# Altium schematic sheet POWER_B3.SchDoc
size A4
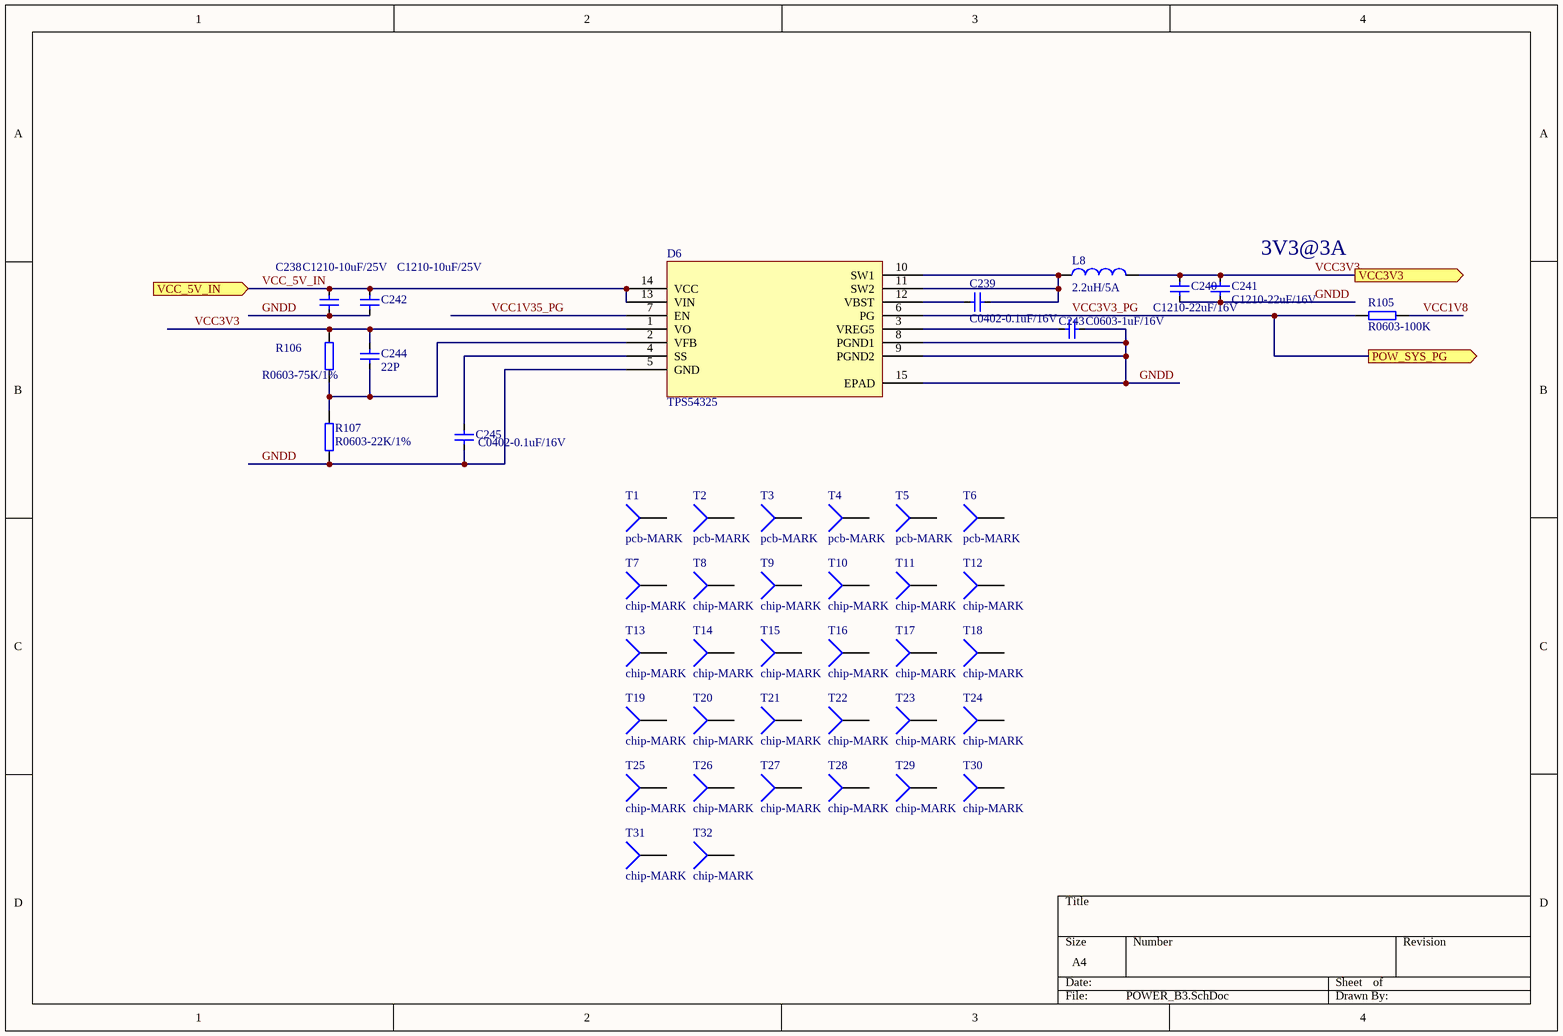
[diagram p0: POWER_B3.SchDoc]

## Parts
C238  C1210-10uF/25V  [C1210]
C239  C0402-0.1uF/16V  [C0402]
C240  C1210-22uF/16V  [C1210]
C241  C1210-22uF/16V  [C1210]
C242  C1210-10uF/25V  [C1210]
C243  C0603-1uF/16V  [C0603]
C244  22P  [C0603]
C245  C0402-0.1uF/16V  [C0402]
D6  TPS54325  [HTSSOP-14]
L8  2.2uH/5A  [LSMD12-13X13]
R105  R0603-100K  [R0603]
R106  R0603-75K/1%  [R0603]
R107  R0603-22K/1%  [R0603]
T1  pcb-MARK  [pcb-MARK]
T2  pcb-MARK  [pcb-MARK]
T3  pcb-MARK  [pcb-MARK]
T4  pcb-MARK  [pcb-MARK]
T5  pcb-MARK  [pcb-MARK]
T6  pcb-MARK  [pcb-MARK]
T7  chip-MARK  [chip-MARK]
T8  chip-MARK  [chip-MARK]
T9  chip-MARK  [chip-MARK]
T10  chip-MARK  [chip-MARK]
T11  chip-MARK  [chip-MARK]
T12  chip-MARK  [chip-MARK]
T13  chip-MARK  [chip-MARK]
T14  chip-MARK  [chip-MARK]
T15  chip-MARK  [chip-MARK]
T16  chip-MARK  [chip-MARK]
T17  chip-MARK  [chip-MARK]
T18  chip-MARK  [chip-MARK]
T19  chip-MARK  [chip-MARK]
T20  chip-MARK  [chip-MARK]
T21  chip-MARK  [chip-MARK]
T22  chip-MARK  [chip-MARK]
T23  chip-MARK  [chip-MARK]
T24  chip-MARK  [chip-MARK]
T25  chip-MARK  [chip-MARK]
T26  chip-MARK  [chip-MARK]
T27  chip-MARK  [chip-MARK]
T28  chip-MARK  [chip-MARK]
T29  chip-MARK  [chip-MARK]
T30  chip-MARK  [chip-MARK]
T31  chip-MARK  [chip-MARK]
T32  chip-MARK  [chip-MARK]

## Ports
POW_SYS_PG (out), VCC3V3 (out), VCC_5V_IN (in)

## Nets
GNDD: C238.2 C240.2 C241.2 C242.2 C243.2 C245.2 D6.5(GND) D6.8(PGND1) D6.9(PGND2) D6.15(EPAD) R107.1
VCC1V8: R105.2
VCC1V35_PG: D6.7(EN)
VCC3V3: C240.1 C241.1 C244.1 D6.1(VO) L8.2 R106.2 ; port VCC3V3
VCC3V3_PG: D6.6(PG) R105.1 ; port POW_SYS_PG
VCC_5V_IN: C238.1 C242.1 D6.13(VIN) D6.14(VCC) ; port VCC_5V_IN
NetC239_1: C239.1 D6.12(VBST)
NetC239_2: C239.2 D6.10(SW1) D6.11(SW2) L8.1
NetC243_1: C243.1 D6.3(VREG5)
NetC244_2: C244.2 D6.2(VFB) R106.1 R107.2
NetC245_1: C245.1 D6.4(SS)

Not connected (* = marked no-connect by the designer): T1 1; T2 1; T3 1; T4 1; T5 1; T6 1; T7 1; T8 1; T9 1; T10 1; T11 1; T12 1; T13 1; T14 1; T15 1; T16 1; T17 1; T18 1; T19 1; T20 1; T21 1; T22 1; T23 1; T24 1; T25 1; T26 1; T27 1; T28 1; T29 1; T30 1; T31 1; T32 1

## Notes on the sheet
- 3V3@3A

## Library data of the parts
C238 C242 = C1210-22uF/16V: Part_number: C1210-10uF/25V; Part_type: CAP; Value: C1210-10uF/25V; Schematic_Part: CAP; PCB_Footprint: C1210
C239 C245 = C0402-0.1uF/16V: X7R; Manufacturer: SAMSUNG; Manufacturer_p/n: CL05X7R104KO5NNN; Part_number: C0402-0.1uF/16V; Part_type: CAP; Value: C0402-0.1uF/16V; temperature: -55℃\+125℃; Schematic_Part: CAP; PCB_Footprint: C0402; datasheet: #DataSheet\C_Samsung_General Capacitors.pdf#
C243 C244 = C0603-100nF/16V: X7R; Part_type: CAP; temperature: -55℃\+125℃; Schematic_Part: CAP; PCB_Footprint: C0603
  C243: Part_number: C0603-1uF/16V; Value: C0603-1uF/16V
  C244: Part_number: 22P; Value: 22P
L8 = LS-6.8uH/5A: Part_number: 2.2uH/5A; Part_type: INDUCTOR; Value1: 6.8uH/5A; Schematic_Part: INDUCTOR; PCB_Footprint: LSMD12-13X13
R105-R107 = R0603-0R: Manufacturer: HKT; Manufacturer_p/n: RI0603L000JT; Part_type: RES; Schematic_Part: RES; PCB_Footprint: R0603; Manufacturer_p/n2: SAMSUNG
  R105: Part_number: R0603-100K; Value: R0603-100K
  R106: Part_number: R0603-75K/1%; Value: R0603-75K/1%
  R107: Part_number: R0603-22K/1%; Value: R0603-22K/1%
T1-T6 = pcb-MARK: PCB标示 MARK点; Part_type: Miscellaneous; Part_number: pcb-MARK; Value: pcb-MARK; Schematic_Part: pcb-MARK; PCB_Footprint: pcb-MARK
T7-T32 = chip-MARK: 芯片标示 MARK点; Part_type: Miscellaneous; Part_number: chip-MARK; Value: chip-MARK; Schematic_Part: chip-MARK; PCB_Footprint: chip-MARK
C240 C241 = C1210-22uF/16V: Part_number: C1210-22uF/16V; Part_type: CAP; Value: C1210-22uF/16V; Schematic_Part: CAP; PCB_Footprint: C1210
D6 = TPS54325: Part_number: TPS54325